# Altium project 20K Control Board V1.1.PrjPCB (part 1 of 6)
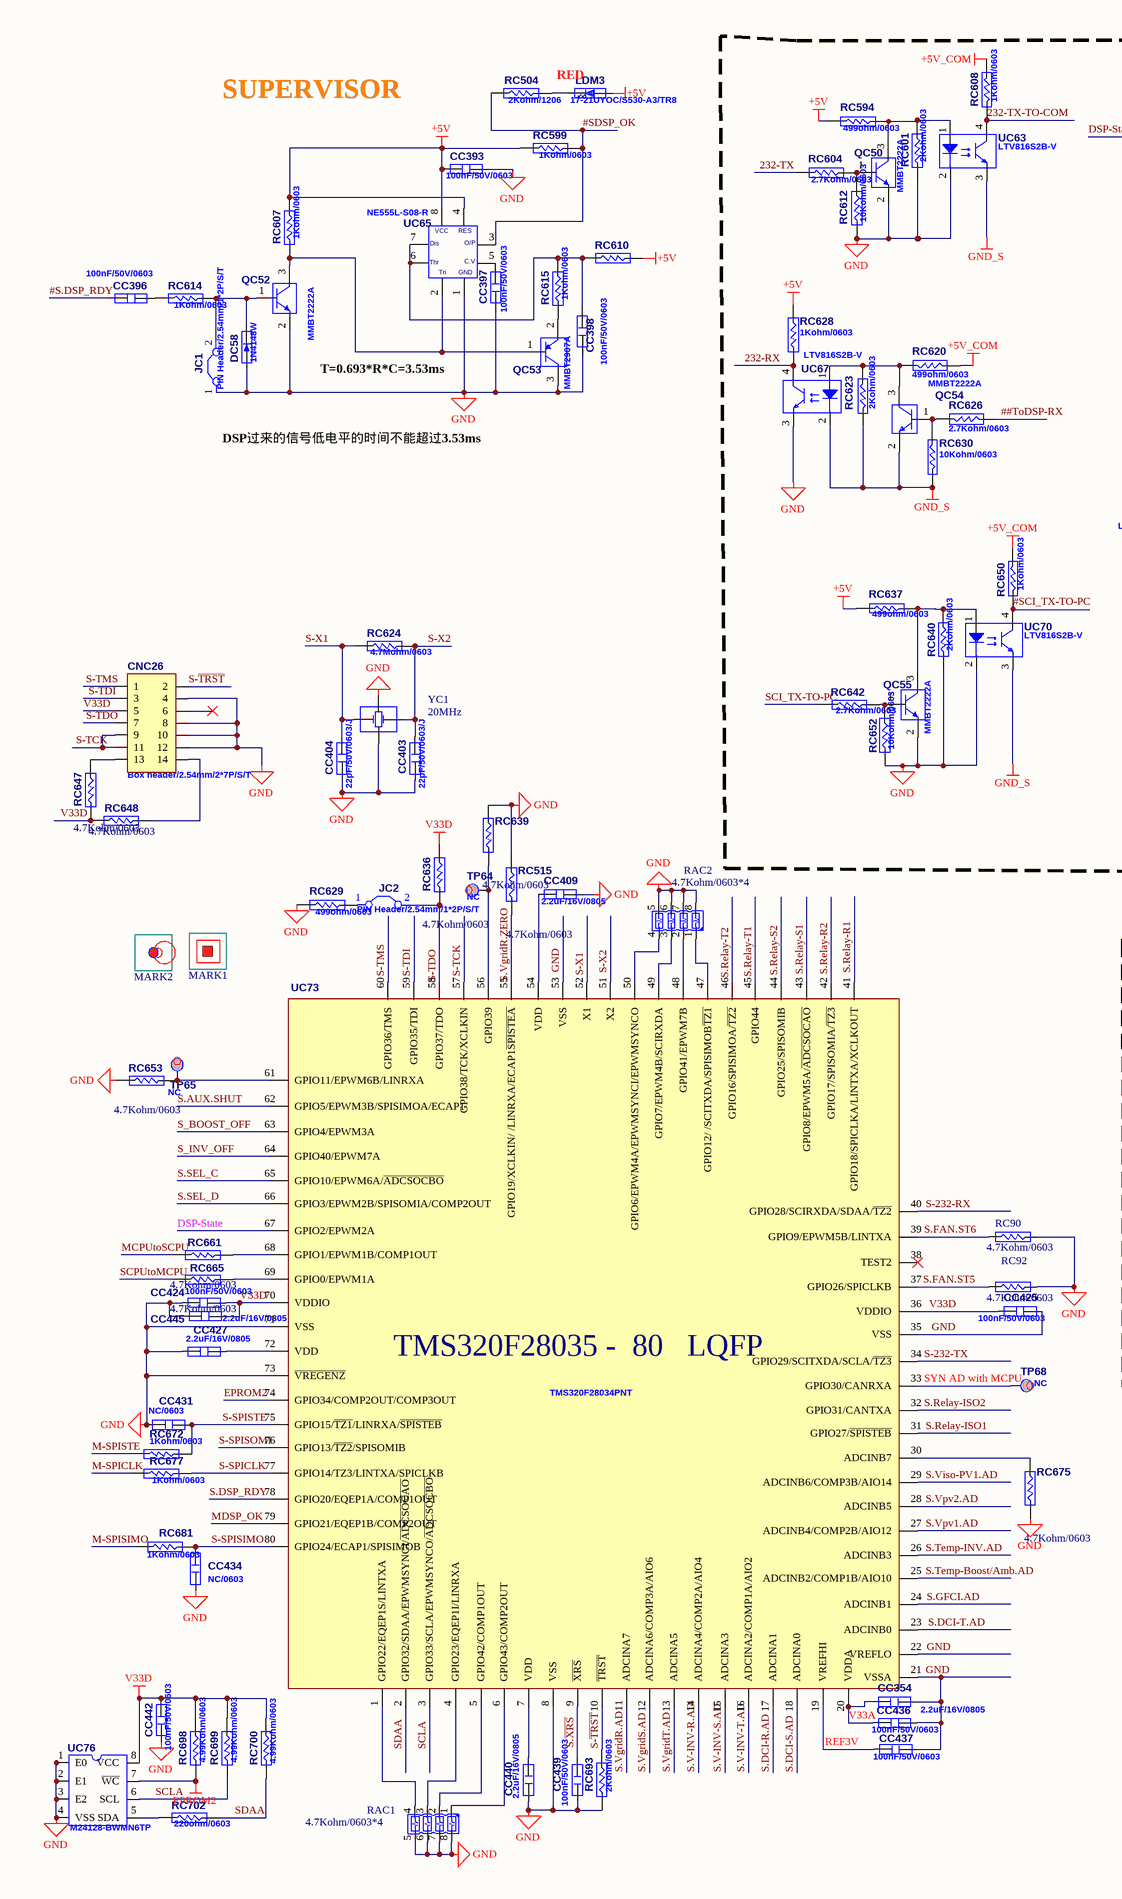
[diagram p0: CPU-S.SchDoc, left]
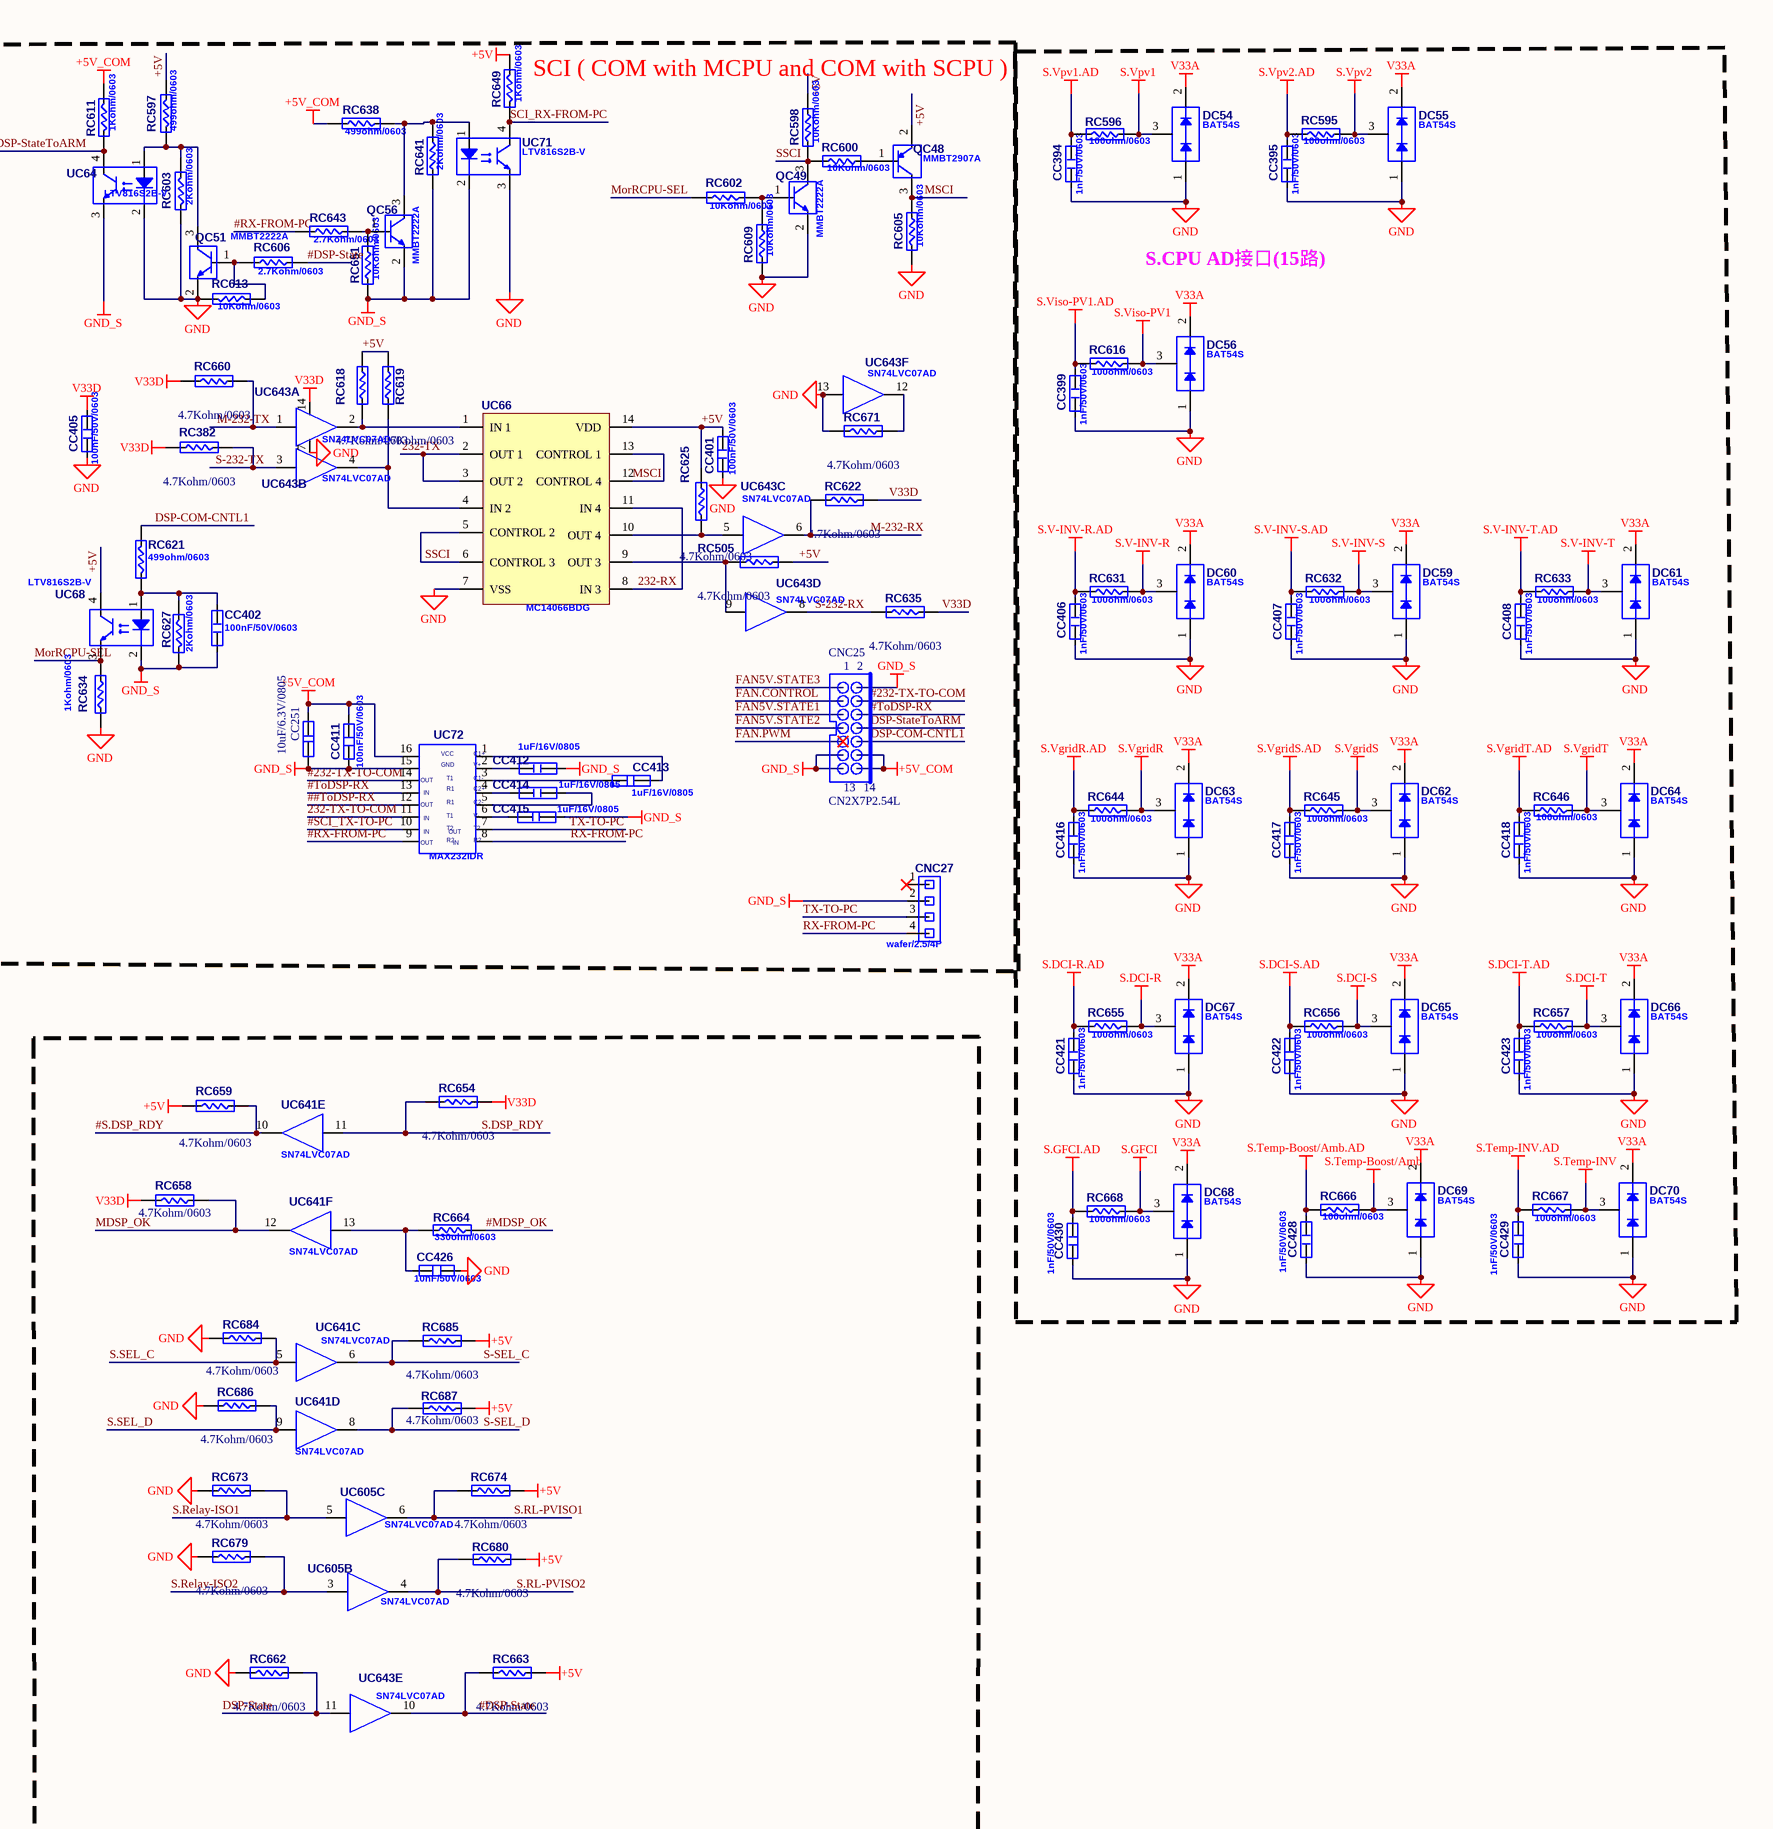
[diagram p1: CPU-S.SchDoc, right]
7 sheets, 1384 parts. Net scope: global (net labels, ports and power ports of the same name join across sheets).
Board file: 20K Control Board V1.1.PcbDoc
Sheets:
  CPU-S.SchDoc
  DC SPS.SchDoc
  Driver.SchDoc
  AD.SchDoc
  CPU M.SchDoc
  IO.SchDoc
  Power.SchDoc

## Sheet CPU-S.SchDoc
size A2

### Parts
CC251  value 10uF/6.3V/0805  [C0805SM]  (hidden comment: 023-106330-0)
CC354  value 2.2uF/16V/0805  [CC2012-0805]  (hidden comment: 023-225330-0)
CC393  value 100nF/50V/0603  [CC1608-0603]  (hidden comment: 023-105220-0)
CC394  value 1nF/50V/0603  [CC1608-0603]  (hidden comment: 023-102220-0)
CC395  value 1nF/50V/0603  [CC1608-0603]  (hidden comment: 023-102220-0)
CC396  value 100nF/50V/0603  [CC1608-0603]  (hidden comment: 023-105220-0)
CC397  value 100nF/50V/0603  [CC1608-0603]  (hidden comment: 023-105220-0)
CC398  value 100nF/50V/0603  [CC1608-0603]  (hidden comment: 023-105220-0)
CC399  value 1nF/50V/0603  [CC1608-0603]  (hidden comment: 023-102220-0)
CC401  value 100nF/50V/0603  [CC1608-0603]  (hidden comment: 023-105220-0)
CC402  value 100nF/50V/0603  [CC1608-0603]  (hidden comment: 023-105220-0)
CC403  value 22pF/50V/0603/J  [CC1608-0603]  (hidden comment: 023-220220-0)
CC404  value 22pF/50V/0603/J  [CC1608-0603]  (hidden comment: 023-220220-0)
CC405  value 100nF/50V/0603  [CC1608-0603]  (hidden comment: 023-105220-0)
CC406  value 1nF/50V/0603  [CC1608-0603]  (hidden comment: 023-102220-0)
CC407  value 1nF/50V/0603  [CC1608-0603]  (hidden comment: 023-102220-0)
CC408  value 1nF/50V/0603  [CC1608-0603]  (hidden comment: 023-102220-0)
CC409  value 2.2uF/16V/0805  [CC2012-0805]  (hidden comment: 023-225330-0)
CC411  value 100nF/50V/0603  [CC1608-0603]  (hidden comment: 023-105220-0)
CC412  value 1uF/16V/0805  [CC2012-0805]  (hidden comment: 023-105330-0)
CC413  value 1uF/16V/0805  [CC2012-0805]  (hidden comment: 023-105330-0)
CC414  value 1uF/16V/0805  [CC2012-0805]  (hidden comment: 023-105330-0)
CC415  value 1uF/16V/0805  [CC2012-0805]  (hidden comment: 023-105330-0)
CC416  value 1nF/50V/0603  [CC1608-0603]  (hidden comment: 023-102220-0)
CC417  value 1nF/50V/0603  [CC1608-0603]  (hidden comment: 023-102220-0)
CC418  value 1nF/50V/0603  [CC1608-0603]  (hidden comment: 023-102220-0)
CC421  value 1nF/50V/0603  [CC1608-0603]  (hidden comment: 023-102220-0)
CC422  value 1nF/50V/0603  [CC1608-0603]  (hidden comment: 023-102220-0)
CC423  value 1nF/50V/0603  [CC1608-0603]  (hidden comment: 023-102220-0)
CC424  value 100nF/50V/0603  [CC1608-0603]  (hidden comment: 023-105220-0)
CC425  value 100nF/50V/0603  [CC1608-0603]  (hidden comment: 023-105220-0)
CC426  value 10nF/50V/0603  [CC1608-0603]  (hidden comment: 023-103220-0)
CC427  value 2.2uF/16V/0805  [CC2012-0805]  (hidden comment: 023-225330-0)
CC428  value 1nF/50V/0603  [CC1608-0603]  (hidden comment: 023-102220-0)
CC429  value 1nF/50V/0603  [CC1608-0603]  (hidden comment: 023-102220-0)
CC430  value 1nF/50V/0603  [CC1608-0603]  (hidden comment: 023-102220-0)
CC431  NC/0603  [CC1608-0603]
CC434  NC/0603  [CC1608-0603]
CC436  value 100nF/50V/0603  [CC1608-0603]  (hidden comment: 023-105220-0)
CC437  value 100nF/50V/0603  [CC1608-0603]  (hidden comment: 023-105220-0)
CC439  value 100nF/50V/0603  [CC1608-0603]  (hidden comment: 023-105220-0)
CC440  value 2.2uF/16V/0805  [CC2012-0805]  (hidden comment: 023-225330-0)
CC442  value 100nF/50V/0603  [CC1608-0603]  (hidden comment: 023-105220-0)
CC445  value 2.2uF/16V/0805  [CC2012-0805]  (hidden comment: 023-225330-0)
CNC25  value CN2X7P2.54L  [CN2.54-2*7P_2]  (hidden comment: 110-103030-0)
CNC26  value Box header/2.54mm/2*7P/S/T  [CN2.54-2*7P]  (hidden comment: 110-100000-0)
CNC27  value wafer/2.5/4P  [CN2.5-4P]  (hidden comment: 110-252000-0)
DC54  value BAT54S  [SOT-23]  (hidden comment: 060-510000-0)
DC55  value BAT54S  [SOT-23]  (hidden comment: 060-510000-0)
DC56  value BAT54S  [SOT-23]  (hidden comment: 060-510000-0)
DC58  value 1N4148W  [SOD-123]  (hidden comment: 060-500010-0)
DC59  value BAT54S  [SOT-23]  (hidden comment: 060-510000-0)
DC60  value BAT54S  [SOT-23]  (hidden comment: 060-510000-0)
DC61  value BAT54S  [SOT-23]  (hidden comment: 060-510000-0)
DC62  value BAT54S  [SOT-23]  (hidden comment: 060-510000-0)
DC63  value BAT54S  [SOT-23]  (hidden comment: 060-510000-0)
DC64  value BAT54S  [SOT-23]  (hidden comment: 060-510000-0)
DC65  value BAT54S  [SOT-23]  (hidden comment: 060-510000-0)
DC66  value BAT54S  [SOT-23]  (hidden comment: 060-510000-0)
DC67  value BAT54S  [SOT-23]  (hidden comment: 060-510000-0)
DC68  value BAT54S  [SOT-23]  (hidden comment: 060-510000-0)
DC69  value BAT54S  [SOT-23]  (hidden comment: 060-510000-0)
DC70  value BAT54S  [SOT-23]  (hidden comment: 060-510000-0)
JC1  value PIN Header/2.54mm/1*2P/S/T  [CN-SIP2.54-2P]  (hidden comment: 110-300001-0)
JC2  value PIN Header/2.54mm/1*2P/S/T  [CN-SIP2.54-2P]  (hidden comment: 110-300001-0)
LDM3  value 17-21UYOC/S530-A3/TR8  [LED2012-0805SM]  (hidden comment: 060-010010-0)
MARK1  NC  [MARK_B]  (value not drawn)
MARK2  NC  [MARK_A]  (value not drawn)
QC48  value MMBT2907A  [SOT-23]  (hidden comment: 061-110000-0)
QC49  value MMBT2222A  [SOT-23]  (hidden comment: 061-010000-0)
QC50  value MMBT2222A  [SOT-23]  (hidden comment: 061-010000-0)
QC51  value MMBT2222A  [SOT-23]  (hidden comment: 061-010000-0)
QC52  value MMBT2222A  [SOT-23]  (hidden comment: 061-010000-0)
QC53  value MMBT2907A  [SOT-23]  (hidden comment: 061-110000-0)
QC54  value MMBT2222A  [SOT-23]  (hidden comment: 061-010000-0)
QC55  value MMBT2222A  [SOT-23]  (hidden comment: 061-010000-0)
QC56  value MMBT2222A  [SOT-23]  (hidden comment: 061-010000-0)
RAC1  value 4.7Kohm/0603*4  [R0603SM*4]  (hidden comment: 019-472000-0)
RAC2  value 4.7Kohm/0603*4  [R0603SM*4]  (hidden comment: 019-472000-0)
RC90  value 4.7Kohm/0603  [R0603SM]  (hidden comment: 011-472020-0)
RC92  value 4.7Kohm/0603  [R0603SM]  (hidden comment: 011-472020-0)
RC382  value 4.7Kohm/0603  [R1608-0603]  (hidden comment: 011-472020-0)
RC504  value 2Kohm/1206  [R3216-1206]  (hidden comment: 011-202050-0)
RC505  value 4.7Kohm/0603  [R1608-0603]  (hidden comment: 011-472020-0)
RC515  value 4.7Kohm/0603  [R1608-0603]  (hidden comment: 011-472020-0)
RC594  value 499ohm/0603  [R1608-0603]  (hidden comment: 011-491020-0)
RC595  value 100ohm/0603  [R1608-0603]  (hidden comment: 011-101020-0)
RC596  value 100ohm/0603  [R1608-0603]  (hidden comment: 011-101020-0)
RC597  value 499ohm/0603  [R1608-0603]  (hidden comment: 011-491020-0)
RC598  value 10Kohm/0603  [R1608-0603]  (hidden comment: 011-103020-0)
RC599  value 1Kohm/0603  [R1608-0603]  (hidden comment: 011-102020-0)
RC600  value 10Kohm/0603  [R1608-0603]  (hidden comment: 011-103020-0)
RC601  value 2Kohm/0603  [R1608-0603]  (hidden comment: 011-202020-0)
RC602  value 10Kohm/0603  [R1608-0603]  (hidden comment: 011-103020-0)
RC603  value 2Kohm/0603  [R1608-0603]  (hidden comment: 011-202020-0)
RC604  value 2.7Kohm/0603  [R1608-0603]  (hidden comment: 011-272020-0)
RC605  value 10Kohm/0603  [R1608-0603]  (hidden comment: 011-103020-0)
RC606  value 2.7Kohm/0603  [R1608-0603]  (hidden comment: 011-272020-0)
RC607  value 1Kohm/0603  [R1608-0603]  (hidden comment: 011-102020-0)
RC608  value 1Kohm/0603  [R1608-0603]  (hidden comment: 011-102020-0)
RC609  value 10Kohm/0603  [R1608-0603]  (hidden comment: 011-103020-0)
RC610  011-493020-0  [R1608-0603]  (value not drawn)
RC611  value 1Kohm/0603  [R1608-0603]  (hidden comment: 011-102020-0)
RC612  value 10Kohm/0603  [R1608-0603]  (hidden comment: 011-103020-0)
RC613  value 10Kohm/0603  [R1608-0603]  (hidden comment: 011-103020-0)
RC614  value 1Kohm/0603  [R1608-0603]  (hidden comment: 011-102020-0)
RC615  value 1Kohm/0603  [R1608-0603]  (hidden comment: 011-102020-0)
RC616  value 100ohm/0603  [R1608-0603]  (hidden comment: 011-101020-0)
RC618  value 4.7Kohm/0603  [R1608-0603]  (hidden comment: 011-472020-0)
RC619  value 4.7Kohm/0603  [R1608-0603]  (hidden comment: 011-472020-0)
RC620  value 499ohm/0603  [R1608-0603]  (hidden comment: 011-491020-0)
RC621  value 499ohm/0603  [R1608-0603]  (hidden comment: 011-491020-0)
RC622  value 4.7Kohm/0603  [R1608-0603]  (hidden comment: 011-472020-0)
RC623  value 2Kohm/0603  [R1608-0603]  (hidden comment: 011-202020-0)
RC624  value 4.7Mohm/0603  [R1608-0603]  (hidden comment: 011-475020-0)
RC625  value 4.7Kohm/0603  [R1608-0603]  (hidden comment: 011-472020-0)
RC626  value 2.7Kohm/0603  [R1608-0603]  (hidden comment: 011-272020-0)
RC627  value 2Kohm/0603  [R1608-0603]  (hidden comment: 011-202020-0)
RC628  value 1Kohm/0603  [R1608-0603]  (hidden comment: 011-102020-0)
RC629  value 499ohm/0603  [R1608-0603]  (hidden comment: 011-491020-0)
RC630  value 10Kohm/0603  [R1608-0603]  (hidden comment: 011-103020-0)
RC631  value 100ohm/0603  [R1608-0603]  (hidden comment: 011-101020-0)
RC632  value 100ohm/0603  [R1608-0603]  (hidden comment: 011-101020-0)
RC633  value 100ohm/0603  [R1608-0603]  (hidden comment: 011-101020-0)
RC634  value 1Kohm/0603  [R1608-0603]  (hidden comment: 011-102020-0)
RC635  value 4.7Kohm/0603  [R1608-0603]  (hidden comment: 011-472020-0)
RC636  value 4.7Kohm/0603  [R1608-0603]  (hidden comment: 011-472020-0)
RC637  value 499ohm/0603  [R1608-0603]  (hidden comment: 011-491020-0)
RC638  value 499ohm/0603  [R1608-0603]  (hidden comment: 011-491020-0)
RC639  value 4.7Kohm/0603  [R1608-0603]  (hidden comment: 011-472020-0)
RC640  value 2Kohm/0603  [R1608-0603]  (hidden comment: 011-202020-0)
RC641  value 2Kohm/0603  [R1608-0603]  (hidden comment: 011-202020-0)
RC642  value 2.7Kohm/0603  [R1608-0603]  (hidden comment: 011-272020-0)
RC643  value 2.7Kohm/0603  [R1608-0603]  (hidden comment: 011-272020-0)
RC644  value 100ohm/0603  [R1608-0603]  (hidden comment: 011-101020-0)
RC645  value 100ohm/0603  [R1608-0603]  (hidden comment: 011-101020-0)
RC646  value 100ohm/0603  [R1608-0603]  (hidden comment: 011-101020-0)
RC647  value 4.7Kohm/0603  [R1608-0603]  (hidden comment: 011-472020-0)
RC648  value 4.7Kohm/0603  [R1608-0603]  (hidden comment: 011-472020-0)
RC649  value 1Kohm/0603  [R1608-0603]  (hidden comment: 011-102020-0)
RC650  value 1Kohm/0603  [R1608-0603]  (hidden comment: 011-102020-0)
RC651  value 10Kohm/0603  [R1608-0603]  (hidden comment: 011-103020-0)
RC652  value 10Kohm/0603  [R1608-0603]  (hidden comment: 011-103020-0)
RC653  value 4.7Kohm/0603  [R1608-0603]  (hidden comment: 011-472020-0)
RC654  value 4.7Kohm/0603  [R1608-0603]  (hidden comment: 011-472020-0)
RC655  value 100ohm/0603  [R1608-0603]  (hidden comment: 011-101020-0)
RC656  value 100ohm/0603  [R1608-0603]  (hidden comment: 011-101020-0)
RC657  value 100ohm/0603  [R1608-0603]  (hidden comment: 011-101020-0)
RC658  value 4.7Kohm/0603  [R1608-0603]  (hidden comment: 011-472020-0)
RC659  value 4.7Kohm/0603  [R1608-0603]  (hidden comment: 011-472020-0)
RC660  value 4.7Kohm/0603  [R1608-0603]  (hidden comment: 011-472020-0)
RC661  value 4.7Kohm/0603  [R1608-0603]  (hidden comment: 011-472020-0)
RC662  value 4.7Kohm/0603  [R1608-0603]  (hidden comment: 011-472020-0)
RC663  value 4.7Kohm/0603  [R1608-0603]  (hidden comment: 011-472020-0)
RC664  value 330ohm/0603  [R1608-0603]  (hidden comment: 011-331020-0)
RC665  value 4.7Kohm/0603  [R1608-0603]  (hidden comment: 011-472020-0)
RC666  value 100ohm/0603  [R1608-0603]  (hidden comment: 011-101020-0)
RC667  value 100ohm/0603  [R1608-0603]  (hidden comment: 011-101020-0)
RC668  value 100ohm/0603  [R1608-0603]  (hidden comment: 011-101020-0)
RC671  value 4.7Kohm/0603  [R1608-0603]  (hidden comment: 011-472020-0)
RC672  value 1Kohm/0603  [R1608-0603]  (hidden comment: 011-102020-0)
RC673  value 4.7Kohm/0603  [R1608-0603]  (hidden comment: 011-472020-0)
RC674  value 4.7Kohm/0603  [R1608-0603]  (hidden comment: 011-472020-0)
RC675  value 4.7Kohm/0603  [R1608-0603]  (hidden comment: 011-472020-0)
RC677  value 1Kohm/0603  [R1608-0603]  (hidden comment: 011-102020-0)
RC679  value 4.7Kohm/0603  [R1608-0603]  (hidden comment: 011-472020-0)
RC680  value 4.7Kohm/0603  [R1608-0603]  (hidden comment: 011-472020-0)
RC681  value 1Kohm/0603  [R1608-0603]  (hidden comment: 011-102020-0)
RC684  value 4.7Kohm/0603  [R1608-0603]  (hidden comment: 011-472020-0)
RC685  value 4.7Kohm/0603  [R1608-0603]  (hidden comment: 011-472020-0)
RC686  value 4.7Kohm/0603  [R1608-0603]  (hidden comment: 011-472020-0)
RC687  value 4.7Kohm/0603  [R1608-0603]  (hidden comment: 011-472020-0)
RC693  value 2Kohm/0603  [R1608-0603]  (hidden comment: 011-202020-0)
RC698  value 4.99Kohm/0603  [R1608-0603]  (hidden comment: 011-492020-0)
RC699  value 4.99Kohm/0603  [R1608-0603]  (hidden comment: 011-492020-0)
RC700  value 4.99Kohm/0603  [R1608-0603]  (hidden comment: 011-492020-0)
RC702  value 220ohm/0603  [R1608-0603]  (hidden comment: 011-221020-0)
TP64  NC  [TEST-12]
TP65  NC  [TEST-12]
TP68  NC  [TEST-12]
UC63  value LTV816S2B-V  [DIP-4-SM-P11-1]  (hidden comment: 050-010022-0)
UC64  value LTV816S2B-V  [DIP-4-SM-P11-1]  (hidden comment: 050-010022-0)
UC65  value NE555L-S08-R  [SO8]  (hidden comment: 050-512010-0)
UC66  value MC14066BDG  [SO14]  (hidden comment: 050-510201-0)
UC67  value LTV816S2B-V  [DIP-4-SM-P11-1]  (hidden comment: 050-010022-0)
UC68  value LTV816S2B-V  [DIP-4-SM-P11-1]  (hidden comment: 050-010022-0)
UC70  value LTV816S2B-V  [DIP-4-SM-P11-1]  (hidden comment: 050-010022-0)
UC71  value LTV816S2B-V  [DIP-4-SM-P11-1]  (hidden comment: 050-010022-0)
UC72  value MAX232IDR  [SO16]  (hidden comment: 050-510000-0)
UC73  value TMS320F28034PNT  [SQFP50P-80]  (hidden comment: 050-410210-0)
UC76  value M24128-BWMN6TP  [SO8]  (hidden comment: 050-110011-0)
UC605  value SN74LVC07AD  [SO14]  (hidden comment: 050-510011-0)  (parts B,C of 6)
UC641  value SN74LVC07AD  [SO14]  (hidden comment: 050-510011-0)  (parts C,D,E,F of 6)
UC643  value SN74LVC07AD  [SO14]  (hidden comment: 050-510011-0)  (parts A,B,C,D,E,F of 6)
YC1  value 20MHz  [XL5032SM]  (hidden comment: 100-100010-0)

### Blocks framed on the sheet
SCI ( COM with MCPU and COM with SCPU ): CC251 CC401 CC402 CC405 CC411-CC415 CNC25 CNC27 QC48-QC51 QC54-QC56 RC382 RC505 RC594 RC597 RC598 RC600-RC606 RC608 RC609 RC611-RC613 RC618-RC623 RC625-RC628 RC630 RC634 RC635 RC637 RC638 RC640-RC643 RC649-RC652 RC660 RC671 UC63 UC64 UC66-UC68 UC70-UC72 UC643

### Nets
#MDSP_OK: RC664.1
#SDSP_OK: RC504.1 RC599.2 UC65.3
+5V: CC393.1 CC401.1 LDM3.1 QC48.2 RC505.1 RC594.2 RC597.2 RC598.2 RC599.1 RC607.1 RC610.2 RC618.1 RC619.1 RC625.1 RC628.2 RC637.2 RC649.2 RC659.1 RC663.2 RC674.2 RC680.1 RC685.2 RC687.2 UC65.4 UC65.8(VCC) UC66.14(VDD) UC68.4
+5V_COM: CC251.2 CC411.2 CNC25.12 CNC25.14 RC608.2 RC611.2 RC620.2 RC638.2 RC650.2 UC72.16
EPROM2: RC698.1 UC73.74(GPIO34/COMP2OUT/COMP3OUT) UC76.7(~{WC})
FAN5V.STATE1: CNC25.5
FAN5V.STATE2: CNC25.7
FAN5V.STATE3: CNC25.1
FAN.CONTROL: CNC25.3
GND: CC354.2 CC393.2 CC394.1 CC395.1 CC397.2 CC398.2 CC399.1 CC401.2 CC403.1 CC404.1 CC405.2 CC406.1 CC407.1 CC408.1 CC409.2 CC416.1 CC417.1 CC418.1 CC421.1 CC422.1 CC423.1 CC424.1 CC425.2 CC426.2 CC427.2 CC428.1 CC429.1 CC430.1 CC431.2 CC434.1 CC436.1 CC437.2 CC439.2 CC440.1 CC442.2 CC445.1 CNC26.4 CNC26.8 CNC26.10 CNC26.12 DC54.1 DC55.1 DC56.1 DC58.1 DC59.1 DC60.1 DC61.1 DC62.1 DC63.1 DC64.1 DC65.1 DC66.1 DC67.1 DC68.1 DC69.1 DC70.1 JC1.1 QC49.2 QC50.2 QC51.2 QC52.2 QC53.3 QC55.2 RAC1.5 RAC1.6 RAC1.7 RAC1.8 RAC2.5 RAC2.6 RAC2.7 RAC2.8 RC90.2 RC92.2 RC515.2 RC601.1 RC603.1 RC605.2 RC609.1 RC612.1 RC613.1 RC629.1 RC634.2 RC639.2 RC640.1 RC652.1 RC653.2 RC662.1 RC671.1 RC673.1 RC675.2 RC679.1 RC684.1 RC686.1 RC693.2 UC63.2 UC64.2 UC65.1(GND) UC66.7(VSS) UC67.3 UC70.2 UC71.3 UC73.8(VSS) UC73.21(VSSA) UC73.22(VREFLO) UC73.35(VSS) UC73.53(VSS) UC73.71(VSS) UC73.73(~{VREGENZ}) UC76.1(E0) UC76.2(E1) UC76.3(E2) UC76.4(VSS) UC643.7 UC643.13 YC1.2 YC1.4
GND_S: CC251.1 CC402.2 CC411.1 CC412.2 CC415.2 CNC25.2 CNC25.11 CNC25.13 CNC27.2 QC54.2 QC56.2 RC623.1 RC627.1 RC630.1 RC641.1 RC651.1 UC63.3 UC64.3 UC67.2 UC68.2 UC70.3 UC71.2 UC72.15
REF3V: CC437.1 UC73.19(VREFHI)
S.DCI-R: DC67.3 RC655.1
S.DCI-R.AD: CC421.2 RC655.2 UC73.17(ADCINA1)
S.DCI-S: DC65.3 RC656.1
S.DCI-S.AD: CC422.2 RC656.2 UC73.18(ADCINA0)
S.DCI-T: DC66.3 RC657.1
S.DCI-T.AD: CC423.2 RC657.2 UC73.23(ADCINB0)
S.GFCI: DC68.3 RC668.1
S.GFCI.AD: CC430.2 RC668.2 UC73.24(ADCINB1)
S.RL-PVISO1: RC674.1 UC605.6
S.RL-PVISO2: RC680.2 UC605.4
S.Temp-Boost/Amb: DC69.3 RC666.1
S.Temp-Boost/Amb.AD: CC428.2 RC666.2 UC73.25(ADCINB2/COMP1B/AIO10)
S.Temp-INV: DC70.3 RC667.1
S.Temp-INV.AD: CC429.2 RC667.2 UC73.26(ADCINB3)
S.V-INV-R: DC60.3 RC631.1
S.V-INV-R.AD: CC406.2 RC631.2 UC73.14(ADCINA4/COMP2A/AIO4)
S.V-INV-S: DC59.3 RC632.1
S.V-INV-S.AD: CC407.2 RC632.2 UC73.15(ADCINA3)
S.V-INV-T: DC61.3 RC633.1
S.V-INV-T.AD: CC408.2 RC633.2 UC73.16(ADCINA2/COMP1A/AIO2)
S.VgridR: DC63.3 RC644.1
S.VgridR.AD: CC416.2 RC644.2 UC73.11(ADCINA7)
S.VgridS: DC62.3 RC645.1
S.VgridS.AD: CC417.2 RC645.2 UC73.12(ADCINA6/COMP3A/AIO6)
S.VgridT: DC64.3 RC646.1
S.VgridT.AD: CC418.2 RC646.2 UC73.13(ADCINA5)
S.Viso-PV1: DC56.3 RC616.1
S.Viso-PV1.AD: CC399.2 RC616.2 UC73.29(ADCINB6/COMP3B/AIO14)
S.Vpv1: DC54.3 RC596.1
S.Vpv1.AD: CC394.2 RC596.2 UC73.27(ADCINB4/COMP2B/AIO12)
S.Vpv2: DC55.3 RC595.1
S.Vpv2.AD: CC395.2 RC595.2 UC73.28(ADCINB5)
V33A: CC354.1 CC436.2 DC54.2 DC55.2 DC56.2 DC59.2 DC60.2 DC61.2 DC62.2 DC63.2 DC64.2 DC65.2 DC66.2 DC67.2 DC68.2 DC69.2 DC70.2 UC73.20(VDDA)
V33D: CC405.1 CC424.2 CC425.1 CC442.1 CC445.2 CNC26.5 RC382.1 RC622.1 RC635.2 RC636.2 RC647.1 RC648.1 RC654.1 RC658.1 RC660.1 RC698.2 RC699.1 RC700.2 UC73.36(VDDIO) UC73.70(VDDIO) UC76.8(VCC) UC643.14
232-RX: RC628.1 UC66.8(IN_3) UC66.11(IN_4) UC67.4
232-TX: RC604.2 UC66.2(OUT_1) UC66.3(OUT_2)
232-TX-TO-COM: RC608.1 UC63.4 UC72.11
#232-TX-TO-COM: CNC25.4 UC72.14
##ToDSP-RX: RC626.2 UC72.12
#DSP-State: RC606.1 RC663.1 UC643.10
#RX-FROM-PC: RC643.2 UC72.9
#S.DSP_RDY: CC396.2 RC659.2 UC641.10
#SCI_TX-TO-PC: RC650.1 UC70.4 UC72.10
#ToDSP-RX: CNC25.6 UC72.13
DSP-COM-CNTL1: CNC25.10 RC621.2
DSP-State: RC662.2 UC73.67(GPIO2/EPWM2A) UC643.11
DSP-StateToARM: CNC25.8 RC611.1 UC64.4
FAN.PWM: CNC25.9
M-232-RX: RC622.2 UC643.6
M-232-TX: RC660.2 UC643.1
M-SPICLK: RC677.2
M-SPISIMO: RC681.2
M-SPISTE: RC672.2
MCPUtoSCPU: RC661.1
MDSP_OK: RC658.2 UC73.79(GPIO21/EQEP1B/COMP2OUT) UC641.12
MorRCPU-SEL: RC602.1 RC634.1 UC68.3
MSCI: QC48.3 RC605.1 UC66.12(CONTROL_4) UC66.13(CONTROL_1)
RX-FROM-PC: CNC27.4 UC72.8
S-232-RX: RC635.1 UC73.40(GPIO28/SCIRXDA/SDAA/~{TZ2}) UC643.8
S-232-TX: RC382.2 UC73.34(GPIO29/SCITXDA/SCLA/~{TZ3}) UC643.3
S-SEL_C: RC685.1 UC641.6
S-SEL_D: RC687.1 UC641.8
S-SPICLK: RC677.1 UC73.77(GPIO14/TZ3/LINTXA/SPICLKB)
S-SPISIMO: CC434.2 RC681.1 UC73.80(GPIO24/ECAP1/SPISIMOB)
S-SPISOMI: UC73.76(GPIO13/~{TZ2}/SPISOMIB)
S-SPISTE: CC431.1 RC672.1 UC73.75(GPIO15/~{TZ1}/LINRXA/~{SPISTEB})
S-~{TRST}: CNC26.2 RC693.1 UC73.10(~{TRST})
S-TCK: CNC26.9 CNC26.11 UC73.57(GPIO38/TCK/XCLKIN)
S-TDI: CNC26.3 UC73.59(GPIO35/TDI)
S-TDO: CNC26.7 JC2.2 RC636.1 UC73.58(GPIO37/TDO)
S-TMS: CNC26.1 UC73.60(GPIO36/TMS)
S-X1: CC404.2 RC624.1 UC73.52(X1) YC1.1
S-X2: CC403.2 RC624.2 UC73.51(X2) YC1.3
S.AUX.SHUT: UC73.62(GPIO5/EPWM3B/SPISIMOA/ECAP1)
S.DSP_RDY: RC654.2 UC73.78(GPIO20/EQEP1A/COMP1OUT) UC641.11
S.FAN.ST5: RC92.1 UC73.37(GPIO26/SPICLKB)
S.FAN.ST6: RC90.1 UC73.39(GPIO9/EPWM5B/LINTXA)
S.Relay-ISO1: RC673.2 UC73.31(GPIO27/~{SPISTEB}) UC605.5
S.Relay-ISO2: RC679.2 UC73.32(GPIO31/CANTXA) UC605.3
S.Relay-R1: UC73.41(GPIO18/SPICLKA/LINTXA/XCLKOUT)
S.Relay-R2: UC73.42(GPIO17/SPISOMIA/~{TZ3})
S.Relay-S1: UC73.43(GPIO8/EPWM5A/~{ADCSOCAO})
S.Relay-S2: UC73.44(GPIO25/SPISOMIB)
S.Relay-T1: UC73.45(GPIO44)
S.Relay-T2: UC73.46(GPIO16/SPISIMOA/~{TZ2})
S.SEL_C: RC684.2 UC73.65(GPIO10/EPWM6A/~{ADCSOCBO}) UC641.5
S.SEL_D: RC686.2 UC73.66(GPIO3/EPWM2B/SPISOMIA/COMP2OUT) UC641.9
S.VgridR.ZERO: RC515.1 UC73.55(GPIO19/XCLKIN/_/LINRXA/ECAP1~{SPISTEA})
S.~{XRS}: CC439.1 UC73.9(~{XRS})
S_BOOST_OFF: UC73.63(GPIO4/EPWM3A)
S_INV_OFF: UC73.64(GPIO40/EPWM7A)
SCI_RX-FROM-PC: RC649.1 UC71.4
SCI_TX-TO-PC: RC642.2
SCLA: RC699.2 UC73.3(GPIO33/SCLA/EPWMSYNCO/~{ADCSOCBO}) UC76.6(SCL)
SCPUtoMCPU: RC665.1
SDAA: RC700.1 RC702.2 UC73.2(GPIO32/SDAA/EPWMSYNCI/~{ADCSOCAO})
SSCI: QC49.3 RC598.1 RC600.1 UC66.5(CONTROL_2) UC66.6(CONTROL_3)
SYN AD with MCPU: TP68.1 UC73.33(GPIO30/CANRXA)
TX-TO-PC: CNC27.3 UC72.7
NetCC396_1: CC396.1 RC614.1
NetCC397_1: CC397.1 UC65.5
NetCC398_1: CC398.1 RC610.1 RC615.2 UC65.6 UC65.7
NetCC402_1: CC402.1 RC621.1 RC627.2 UC68.1
NetCC409_1: CC409.1 UC73.54(VDD)
NetCC412_1: CC412.1 UC72.2
NetCC413_1: CC413.1 UC72.3
NetCC413_2: CC413.2 UC72.1
NetCC414_1: CC414.1 UC72.4
NetCC414_2: CC414.2 UC72.5
NetCC415_1: CC415.1 UC72.6
NetCC426_1: CC426.1 RC664.2 UC641.13
NetCC427_1: CC427.1 UC73.72(VDD)
NetCC440_2: CC440.2 UC73.7(VDD)
NetCNC26_13: CNC26.13 RC647.2
NetCNC26_14: CNC26.14 RC648.2
NetDC58_2: DC58.2 JC1.2 QC52.1 RC614.2
NetJC2_1: JC2.1 RC629.2
NetLDM3_2: LDM3.2 RC504.2
NetQC48_1: QC48.1 RC600.2
NetQC49_1: QC49.1 RC602.2 RC609.2
NetQC50_1: QC50.1 RC604.1 RC612.2
NetQC50_3: QC50.3 RC594.1 RC601.2 UC63.1
NetQC51_1: QC51.1 RC606.2 RC613.2
NetQC51_3: QC51.3 RC597.1 RC603.2 UC64.1
NetQC52_3: QC52.3 QC53.1 RC607.2 UC65.2
NetQC53_2: QC53.2 RC615.1
NetQC54_1: QC54.1 RC626.1 RC630.2
NetQC54_3: QC54.3 RC620.1 RC623.2 UC67.1
NetQC55_1: QC55.1 RC642.1 RC652.2
NetQC55_3: QC55.3 RC637.1 RC640.2 UC70.1
NetQC56_1: QC56.1 RC643.1 RC651.2
NetQC56_3: QC56.3 RC638.1 RC641.2 UC71.1
NetRAC1_1: RAC1.1 UC73.6(GPIO43/COMP2OUT)
NetRAC1_2: RAC1.2 UC73.5(GPIO42/COMP1OUT)
NetRAC1_3: RAC1.3 UC73.4(GPIO23/EQEP1I/LINRXA)
NetRAC1_4: RAC1.4 UC73.1(GPIO22/EQEP1S/LINTXA)
NetRAC2_1: RAC2.1 UC73.47(GPIO12/_/SCITXDA/SPISIMOB~{TZ1})
NetRAC2_2: RAC2.2 UC73.48(GPIO41/EPWM7B)
NetRAC2_3: RAC2.3 UC73.49(GPIO7/EPWM4B/SCIRXDA)
NetRAC2_4: RAC2.4 UC73.50(GPIO6/EPWM4A/EPWMSYNCI/EPWMSYNCO)
NetRC505_2: RC505.2 UC66.9(OUT_3) UC643.9
NetRC618_2: RC618.2 UC66.1(IN_1) UC643.2
NetRC619_2: RC619.2 UC66.4(IN_2) UC643.4
NetRC625_2: RC625.2 UC66.10(OUT_4) UC643.5
NetRC639_1: RC639.1 TP64.1 UC73.56(GPIO39)
NetRC653_1: RC653.1 TP65.1 UC73.61(GPIO11/EPWM6B/LINRXA)
NetRC661_2: RC661.2 UC73.68(GPIO1/EPWM1B/COMP1OUT)
NetRC665_2: RC665.2 UC73.69(GPIO0/EPWM1A)
NetRC671_2: RC671.2 UC643.12
NetRC675_1: RC675.1 UC73.30(ADCINB7)
NetRC702_1: RC702.1 UC76.5(SDA)

Not connected (* = marked no-connect by the designer): CNC26 6*; CNC27 1*; UC73 38(TEST2)*

### Notes on the sheet
- SUPERVISOR
- (near LDM3) RED
- S.CPU AD接口(15路)
- T=0.693*R*C=3.53ms
- (near JC1) DSP过来的信号低电平的时间不能超过3.53ms
- (in symbol IC 555SM) RES; Dis; O/P; Thr; C.V; Tri
- (in symbol IC-TMS320F28035) TMS320F28035 -  80   LQFP
- (in symbol MAX232SM_1) VCC; C1+; GND; V+; OUT; T1; C1-; IN; R1; C2+; C2-; V-; T2; R2

### Library data of the parts
CC251 = 023-106330-0 C0805SM: 10uF/6.3V/K/X7R/0805; Name of Material: 陶瓷电容; Vendor: SAMSUNG; Factory model: CL21B106KQQNNNE; Assembly type: 贴片; PN: 023-106330-0
CC354 CC445 = CC0805-225/16VSM: 2.2uF/16V/K/X7R/0805; Part Type: SMD
CC393 CC396-CC398 CC401 CC402 CC405 CC411 CC424 CC425 CC436 CC437 CC439 CC442 = C0603 SM: 100nF/50V/J/X7R/0603
CC394 CC395 CC399 CC406-CC408 CC416-CC418 CC421-CC423 CC428-CC430 = C0603 SM: 1nF/50V/J/C0G/0603
CC403 CC404 = C0603 SM: 22pF/50V/J/C0G/0603
CC409 CC427 CC440 = C0805 SM: 2.2uF/16V/K/X7R/0805
CC412-CC415 = C0805TSM: 1uF/16V/K/X7R/0805
CC426 = C0603 SM: 10nF/50V/J/X7R/0603
CC431 = C0603 SM: PN: 023-104320-0; Value: NC/0603
CC434 = C0603 SM: PN: 023-221220-0; Value: NC/0603
CNC25 = CN2X7P2.54L: Ejector Header/2.54mm/2*7P/S/T; 物料名称: 连接器; H: 8.3MM; 替代料: *; PN: *; Vendor: *
CNC26 = CN2.54-2*7P: Box header/2.54mm/2*7P/S/T; Vendor: 广联威; Part Type: THD
CNC27 = CN 25P04: Wafer/2.5 pitch/4 pin/182度/白胶/带卡勾; Part Type: THD
DC54-DC56 DC59-DC70 = BAT54S: 0.2A/30V/SOT-23
DC58 = D 1N4148W: 0.15A/75V/SOD-123; Type: 贴片
JC1 JC2 = CN-Jumper2.54-2P: PIN Header/2.54mm/1*2P/S/T; Vendor: GUANGLIANWEI; Part Type: THD
LDM3 = LD0805SM: 2.0*1.25*0.75mm/Orange
MARK1 = MARK_B: 单位: PCS; H: MM; Value: NC
MARK2 = MARK_A: 单位: PCS; H: MM; Value: NC
QC48 QC53 = TR 2907SM: 0.6A/60VDC/SOT-23
  QC48: Type: SMD
QC49-QC52 QC54-QC56 = TR 2222SM: 0.6A/40VDC/SOT-23
RAC1 RAC2 = 019-472000-0 R0603SM*4: 4.7Kohm/J/0603*4; Name of Material: 厚膜晶片排阻; Vendor: RALEC; Factory model: RTA03-4D4K7JTP; Assembly type: 贴片; PN: 019-472000-0
RC90 RC92 = 011-472020-0 R0603SM: 4.7Kohm/1/10W/F/0603; Name of Material: 厚膜电阻; Vendor: RALEC/YAGEO; Factory model: RTT03 4K7F TP/RC0603FR-074K7L; Assembly type: 贴片; PN: 011-472020-0
RC382 RC505 RC515 RC618 RC619 RC622 RC625 RC635 RC636 RC639 RC647 RC648 RC653 RC654 RC658-RC663 RC665 RC671 RC673-RC675 RC679 RC680 RC684-RC687 = R0603SM: 4.7Kohm/1/10W/F/0603
RC504 = R1206SM: 2Kohm/1/4W/F/1206
RC594 RC597 RC620 RC621 RC629 RC637 RC638 = R0603SM: 499ohm/1/10W/F/0603
RC595 RC596 RC616 RC631-RC633 RC644-RC646 RC655-RC657 RC666-RC668 = R0603SM: 100ohm/1/10W/F/0603
RC598 RC600 RC602 RC605 RC609 RC612 RC613 RC630 RC651 RC652 = R0603SM: 10Kohm/1/10W/F/0603
RC599 RC607 RC608 RC611 RC614 RC615 RC628 RC634 RC649 RC650 RC672 RC677 RC681 = R0603SM: 1Kohm/1/10W/F/0603
RC601 RC603 RC623 RC627 RC640 RC641 RC693 = R0603SM: 2Kohm/1/10W/F/0603
RC604 RC606 RC626 RC642 RC643 = R0603SM: 2.7Kohm/1/10W/F/0603
RC610 = R0603SM: 49.9Kohm/1/10W/F/0603; Value: 49.9Kohm/0603
RC624 = R0603SM: 4.7Mohm/1/10W/F/0603
RC664 = R0603SM: 330ohm/1/10W/F/0603
RC698-RC700 = R0603SM: 4.99Kohm/1/10W/F/0603
RC702 = R0603SM: 220ohm/1/10W/F/0603
TP64 TP65 TP68 = 17K TPD: Type: 插件; Value: NC
UC63 UC64 UC67 UC68 UC70 UC71 = OPTO 2561L2-1SM: Optocoupler/SO-4
UC65 = IC 555SM: NE555 Single Timer/SOP-8
UC66 = IC 14066B: Quad Muliplexer/SOIC-14; Part Type: SMD
UC72 = MAX232SM_1: Driver/Receiver/SOIC-16
UC73 = IC-TMS320F28035: Microcontroller/80-Pin PN LQFP; Part Type: SMD
UC76 = IC M24128SM: EEPROM/SO-8; Vendor: ST; Part Type: SMD
UC605 UC641 UC643 = 17K IC SN74LVC07AD: Hex Buffer/Driver/SOIC-14; Type: 贴片
YC1 = 100-100010-0 XL5032SM: 20MHz/18pF/±10ppm/5.0*3.2; Name of Material: 晶振; Vendor: TXC; Factory model: 7B20000006; Assembly type: 贴片; PN: 100-100010-0